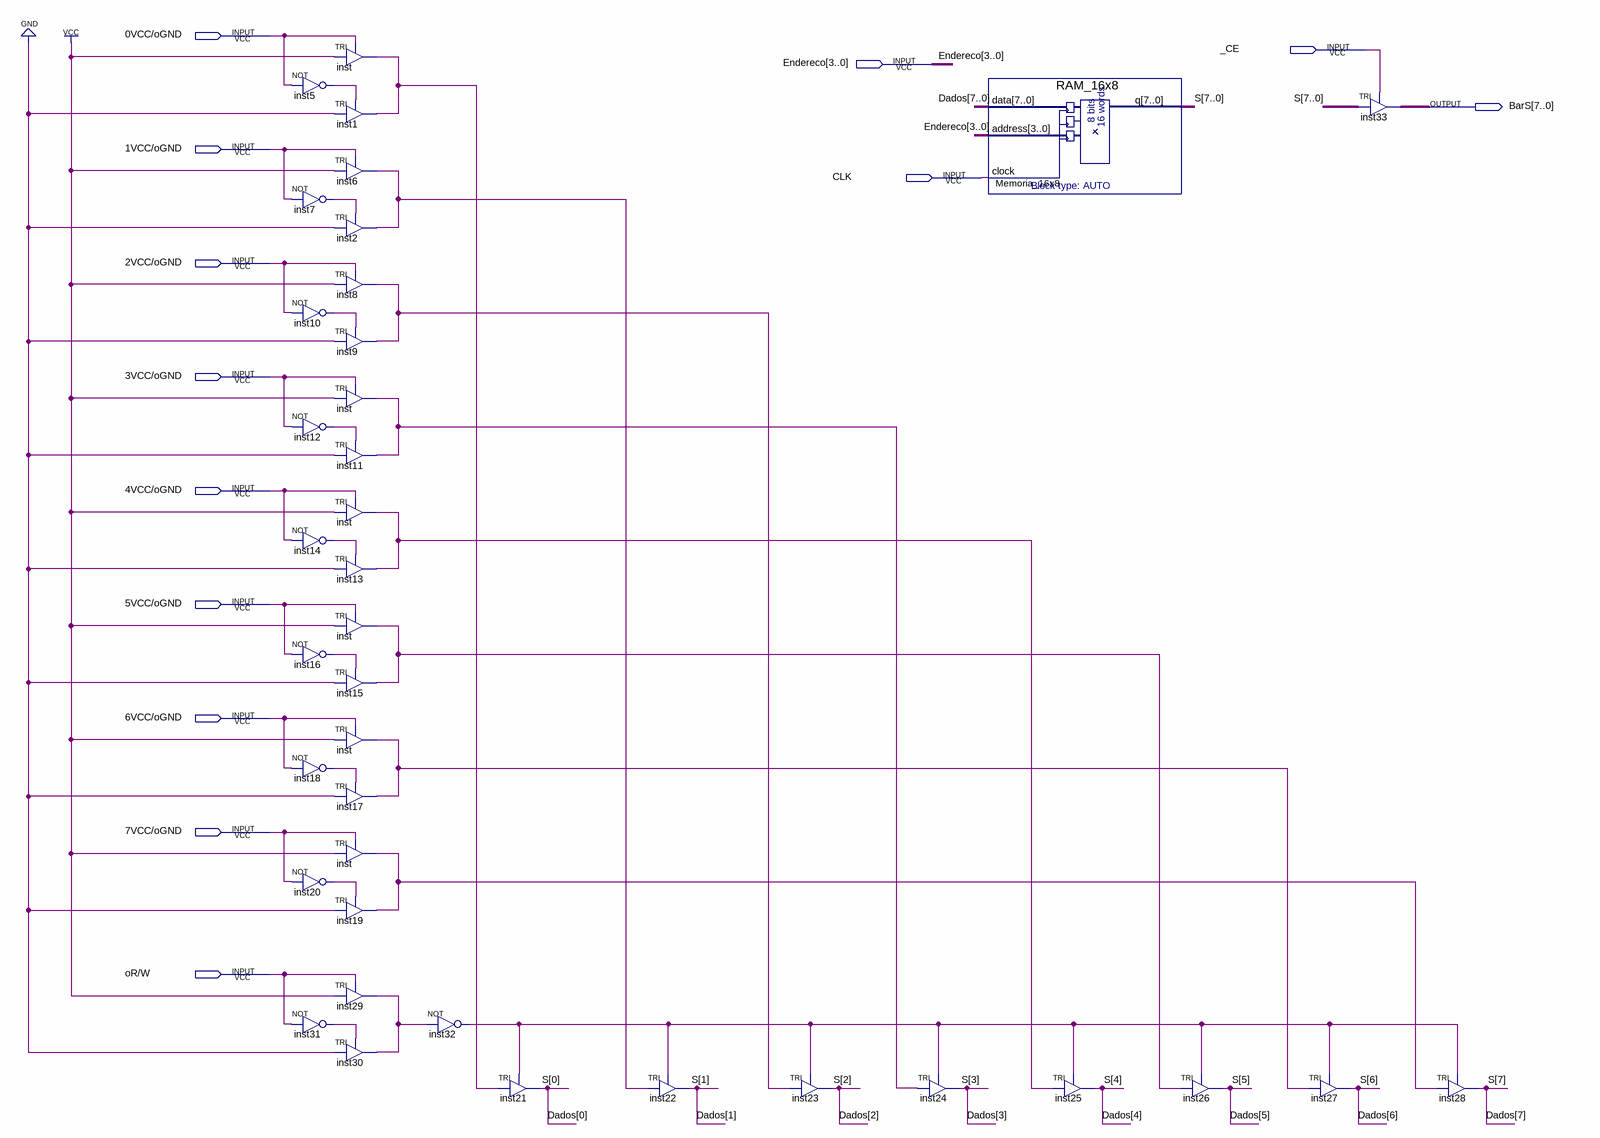
[diagram p0: schematic sheet]
// Quartus schematic Memoria_16x8.bdf as structural Verilog: 38 symbols, 13 pins
module Memoria_16x8 (
  input  \0VCC/oGND ,
  input  _CE,
  input  [3:0] Endereco,
  input  \1VCC/oGND ,
  input  CLK,
  input  \2VCC/oGND ,
  input  \3VCC/oGND ,
  input  \4VCC/oGND ,
  input  \5VCC/oGND ,
  input  \6VCC/oGND ,
  input  \7VCC/oGND ,
  input  \oR/W ,
  output [7:0] BarS
);

  wire inst5_out, inst6_out, inst7_out, inst8_out, inst10_out, inst12_out, inst14_out, inst16_out,
       inst18_out, inst20_out, inst29_out, inst31_out, inst32_out, inst_out, inst_out_2, inst_out_3,
       inst_out_4, inst_out_5, inst_out_6;
  wire [7:0] Dados;

  not inst5 (inst5_out, \0VCC/oGND );
  not inst7 (inst7_out, \1VCC/oGND );
  not inst10 (inst10_out, \2VCC/oGND );
  not inst12 (inst12_out, \3VCC/oGND );
  not inst14 (inst14_out, \4VCC/oGND );
  not inst16 (inst16_out, \5VCC/oGND );
  not inst18 (inst18_out, \6VCC/oGND );
  not inst20 (inst20_out, \7VCC/oGND );
  not inst31 (inst31_out, \oR/W );
  TRI inst (.IN(1'b1), .OE(\0VCC/oGND ), .OUT(inst_out_3));
  TRI inst1 (.IN(1'b0), .OE(inst5_out), .OUT(inst_out_3));
  TRI inst6 (.IN(1'b1), .OE(\1VCC/oGND ), .OUT(inst6_out));
  TRI inst2 (.IN(1'b0), .OE(inst7_out), .OUT(inst6_out));
  TRI inst8 (.IN(1'b1), .OE(\2VCC/oGND ), .OUT(inst8_out));
  TRI inst9 (.IN(1'b0), .OE(inst10_out), .OUT(inst8_out));
  TRI inst_dup2 (.IN(1'b1), .OE(\3VCC/oGND ), .OUT(inst_out));
  TRI inst11 (.IN(1'b0), .OE(inst12_out), .OUT(inst_out));
  TRI inst_dup3 (.IN(1'b1), .OE(\4VCC/oGND ), .OUT(inst_out_4));
  TRI inst13 (.IN(1'b0), .OE(inst14_out), .OUT(inst_out_4));
  TRI inst_dup4 (.IN(1'b1), .OE(\5VCC/oGND ), .OUT(inst_out_2));
  TRI inst15 (.IN(1'b0), .OE(inst16_out), .OUT(inst_out_2));
  TRI inst_dup5 (.IN(1'b1), .OE(\6VCC/oGND ), .OUT(inst_out_5));
  TRI inst17 (.IN(1'b0), .OE(inst18_out), .OUT(inst_out_5));
  TRI inst_dup6 (.IN(1'b1), .OE(\7VCC/oGND ), .OUT(inst_out_6));
  TRI inst19 (.IN(1'b0), .OE(inst20_out), .OUT(inst_out_6));
  TRI inst29 (.IN(1'b1), .OE(\oR/W ), .OUT(inst29_out));
  TRI inst30 (.IN(1'b0), .OE(inst31_out), .OUT(inst29_out));
  not inst32 (inst32_out, inst29_out);
  TRI inst21 (.IN(inst_out_3), .OE(inst32_out), .OUT(Dados[0]));
  TRI inst22 (.IN(inst6_out), .OE(inst32_out), .OUT(Dados[1]));
  TRI inst23 (.IN(inst8_out), .OE(inst32_out), .OUT(Dados[2]));
  TRI inst24 (.IN(inst_out), .OE(inst32_out), .OUT(Dados[3]));
  RAM_16x8 Memoria_16x8 (.data(Dados), .address(Endereco), .clock(CLK), .q(Dados));
  TRI inst25 (.IN(inst_out_4), .OE(inst32_out), .OUT(Dados[4]));
  TRI inst26 (.IN(inst_out_2), .OE(inst32_out), .OUT(Dados[5]));
  TRI inst27 (.IN(inst_out_5), .OE(inst32_out), .OUT(Dados[6]));
  TRI inst33[7:0] (.IN(Dados), .OE(_CE), .OUT(BarS));
  TRI inst28 (.IN(inst_out_6), .OE(inst32_out), .OUT(Dados[7]));

  // Other names for the same wires on the sheet: S[7:0] = Dados
endmodule
